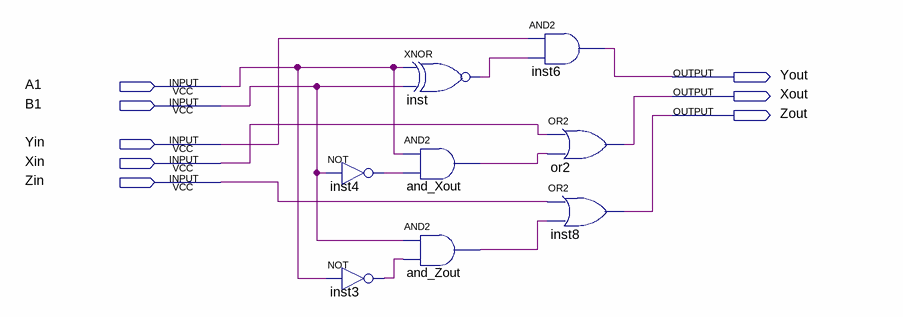
[diagram p0: schematic sheet]
// Quartus schematic Cmp1bit.bdf as structural Verilog: 8 symbols, 8 pins
module Cmp1bit (
  input  A1,
  input  B1,
  input  Yin,
  input  Xin,
  input  Zin,
  output Yout,
  output Xout,
  output Zout
);

  wire and_Xout_out, and_Zout_out, inst3_out, inst4_out, inst_out;

  not inst4 (inst4_out, B1);
  not inst3 (inst3_out, A1);
  xnor inst (inst_out, A1, B1);
  and and_Xout (and_Xout_out, A1, inst4_out);
  and and_Zout (and_Zout_out, B1, inst3_out);
  and inst6 (Yout, Yin, inst_out);
  or or2 (Xout, Xin, and_Xout_out);
  or inst8 (Zout, Zin, and_Zout_out);
endmodule
